# Altium schematic sheet B2B_Connectors.SchDoc: ESCBackerBoard_B2B_Connectors
size Letter; Organization: Colorado School of Mines; Address1: 1500 Illinois St.; Address2: Golden; Address3: CO 80401; Address4: USA; DocumentNumber: 0000; Revision: V1.0; SheetNumber: 2; SheetTotal: 2
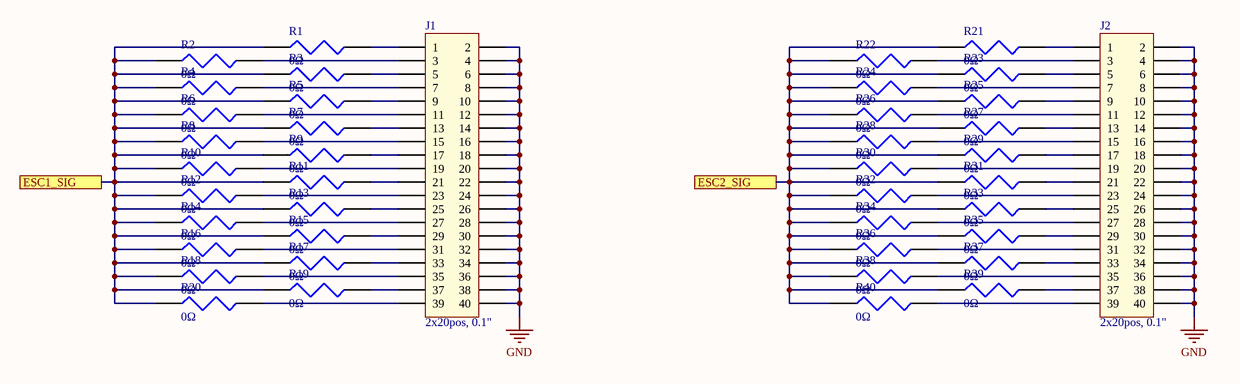
[diagram p0: B2B_Connectors.SchDoc]

## Parts
J1  2x20pos, 0.1"  [1979]
J2  2x20pos, 0.1"  [1979]
R1  0Ω  [RMCF1206]
R2  0Ω  [RMCF1206]
R3  0Ω  [RMCF1206]
R4  0Ω  [RMCF1206]
R5  0Ω  [RMCF1206]
R6  0Ω  [RMCF1206]
R7  0Ω  [RMCF1206]
R8  0Ω  [RMCF1206]
R9  0Ω  [RMCF1206]
R10  0Ω  [RMCF1206]
R11  0Ω  [RMCF1206]
R12  0Ω  [RMCF1206]
R13  0Ω  [RMCF1206]
R14  0Ω  [RMCF1206]
R15  0Ω  [RMCF1206]
R16  0Ω  [RMCF1206]
R17  0Ω  [RMCF1206]
R18  0Ω  [RMCF1206]
R19  0Ω  [RMCF1206]
R20  0Ω  [RMCF1206]
R21  0Ω  [RMCF1206]
R22  0Ω  [RMCF1206]
R23  0Ω  [RMCF1206]
R24  0Ω  [RMCF1206]
R25  0Ω  [RMCF1206]
R26  0Ω  [RMCF1206]
R27  0Ω  [RMCF1206]
R28  0Ω  [RMCF1206]
R29  0Ω  [RMCF1206]
R30  0Ω  [RMCF1206]
R31  0Ω  [RMCF1206]
R32  0Ω  [RMCF1206]
R33  0Ω  [RMCF1206]
R34  0Ω  [RMCF1206]
R35  0Ω  [RMCF1206]
R36  0Ω  [RMCF1206]
R37  0Ω  [RMCF1206]
R38  0Ω  [RMCF1206]
R39  0Ω  [RMCF1206]
R40  0Ω  [RMCF1206]

## Ports
ESC1_SIG, ESC2_SIG

## Nets
GND: J1.2 J1.4 J1.6 J1.8 J1.10 J1.12 J1.14 J1.16 J1.18 J1.20 J1.22 J1.24 J1.26 J1.28 J1.30 J1.32 J1.34 J1.36 J1.38 J1.40 J2.2 J2.4 J2.6 J2.8 J2.10 J2.12 J2.14 J2.16 J2.18 J2.20 J2.22 J2.24 J2.26 J2.28 J2.30 J2.32 J2.34 J2.36 J2.38 J2.40
ESC1_SIG: R1.1 R2.1 R3.1 R4.1 R5.1 R6.1 R7.1 R8.1 R9.1 R10.1 R11.1 R12.1 R13.1 R14.1 R15.1 R16.1 R17.1 R18.1 R19.1 R20.1 ; port ESC1_SIG
ESC2_SIG: R21.1 R22.1 R23.1 R24.1 R25.1 R26.1 R27.1 R28.1 R29.1 R30.1 R31.1 R32.1 R33.1 R34.1 R35.1 R36.1 R37.1 R38.1 R39.1 R40.1 ; port ESC2_SIG
NetJ1_1: J1.1 R1.2
NetJ1_3: J1.3 R2.2
NetJ1_5: J1.5 R3.2
NetJ1_7: J1.7 R4.2
NetJ1_9: J1.9 R5.2
NetJ1_11: J1.11 R6.2
NetJ1_13: J1.13 R7.2
NetJ1_15: J1.15 R8.2
NetJ1_17: J1.17 R9.2
NetJ1_19: J1.19 R10.2
NetJ1_21: J1.21 R11.2
NetJ1_23: J1.23 R12.2
NetJ1_25: J1.25 R13.2
NetJ1_27: J1.27 R14.2
NetJ1_29: J1.29 R15.2
NetJ1_31: J1.31 R16.2
NetJ1_33: J1.33 R17.2
NetJ1_35: J1.35 R18.2
NetJ1_37: J1.37 R19.2
NetJ1_39: J1.39 R20.2
NetJ2_1: J2.1 R21.2
NetJ2_3: J2.3 R22.2
NetJ2_5: J2.5 R23.2
NetJ2_7: J2.7 R24.2
NetJ2_9: J2.9 R25.2
NetJ2_11: J2.11 R26.2
NetJ2_13: J2.13 R27.2
NetJ2_15: J2.15 R28.2
NetJ2_17: J2.17 R29.2
NetJ2_19: J2.19 R30.2
NetJ2_21: J2.21 R31.2
NetJ2_23: J2.23 R32.2
NetJ2_25: J2.25 R33.2
NetJ2_27: J2.27 R34.2
NetJ2_29: J2.29 R35.2
NetJ2_31: J2.31 R36.2
NetJ2_33: J2.33 R37.2
NetJ2_35: J2.35 R38.2
NetJ2_37: J2.37 R39.2
NetJ2_39: J2.39 R40.2

## Notes on the sheet
- Title
- Size:
- Date:
- Letter
- Number:
- Time:
- Revision:
- Sheet
- of
- File:

## Library data of the parts
J1 J2 = 1979: Adafruit STACKING HEADER RASPBERRY PI; Manufacturer: Adafruit; Part Number: 1979; Value: 2x20pos, 0.1"; ComponentLink1Description: DigiKey; ComponentLink1URL: https://www.digikey.com/en/products/detail/adafruit-industries-llc/1979/6238003?utm_adgroup=Accessories&utm_source=google&utm_medium=cpc&utm_campaign=Shopping_Product_Development%20Boards%2C%20Kits%2C%20Programmers_NEW&utm_term=&utm_content=Accessories&gclid=CjwKCAjwzruGBhBAEiwAUqMR8EJmk7tgiLxUlbO6Gr5x5WmlUK_tnBqJhDCD_TRLtZ5IBbXMVM3f2xoCyKwQAvD_BwE
R1-R40 = RMCF1206ZT0R00: Stackpole RES 0 OHM 1/4W 1206; Manufacturer: Stackpole Electronics Inc; Part Number: RMCF1206ZT0R00; Value: 0Ω; ComponentLink1Description: DigiKey; ComponentLink1URL: https://www.digikey.com/en/products/detail/stackpole-electronics-inc/RMCF1206ZT0R00/1756906